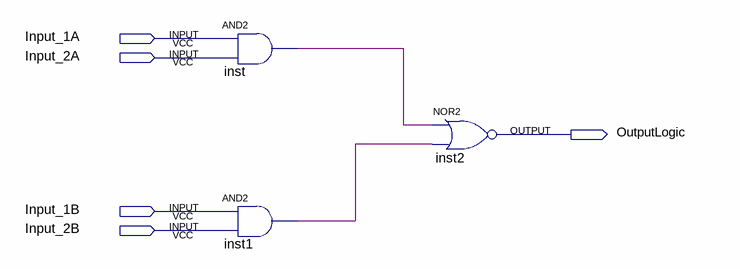
[diagram p0: schematic sheet]
// Quartus schematic Diagram.bdf as structural Verilog: 3 symbols, 5 pins
module Diagram (
  input  Input_1A,
  input  Input_2A,
  input  Input_1B,
  input  Input_2B,
  output OutputLogic
);

  wire inst1_out, inst_out;

  and inst (inst_out, Input_1A, Input_2A);
  and inst1 (inst1_out, Input_1B, Input_2B);
  nor inst2 (OutputLogic, inst_out, inst1_out);
endmodule
